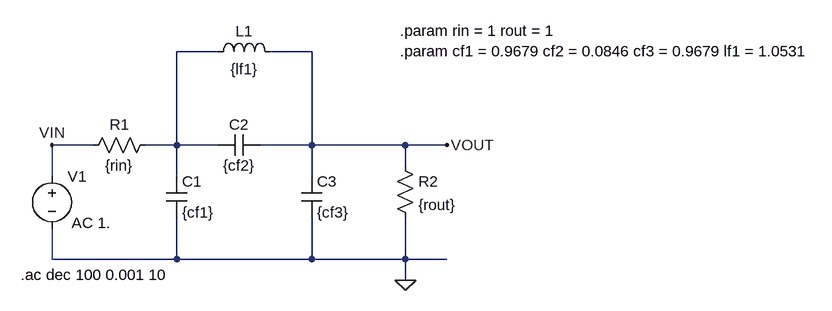
[diagram p0: schematic cauer_passive_filter.asc]
cauer_passive_filter.asc, the LTspice schematic file:
Version 4.1
SHEET 1 1188 680
WIRE 208 -64 144 -64
WIRE 352 -64 288 -64
WIRE 16 80 -48 80
WIRE 144 80 144 -64
WIRE 144 80 96 80
WIRE 208 80 144 80
WIRE 352 80 352 -64
WIRE 352 80 272 80
WIRE 496 80 352 80
WIRE 560 80 496 80
WIRE 496 112 496 80
WIRE -48 128 -48 80
WIRE 144 128 144 80
WIRE 352 128 352 80
WIRE -48 256 -48 208
WIRE 144 256 144 192
WIRE 144 256 -48 256
WIRE 352 256 352 192
WIRE 352 256 144 256
WIRE 496 256 496 192
WIRE 496 256 352 256
WIRE 560 256 496 256
WIRE 496 288 496 256
FLAG 496 288 0
FLAG -48 80 VIN
FLAG 560 80 VOUT
SYMBOL res 112 64 R90
WINDOW 0 0 56 VBottom 2
WINDOW 3 32 56 VTop 2
SYMATTR InstName R1
SYMATTR Value {rin}
SYMBOL cap 128 128 R0
SYMATTR InstName C1
SYMATTR Value {cf1}
SYMBOL cap 272 64 R90
WINDOW 0 0 32 VBottom 2
WINDOW 3 32 32 VTop 2
SYMATTR InstName C2
SYMATTR Value {cf2}
SYMBOL ind 192 -48 R270
WINDOW 0 32 56 VTop 2
WINDOW 3 5 56 VBottom 2
SYMATTR InstName L1
SYMATTR Value {lf1}
SYMATTR SpiceLine Rser=1m
SYMBOL cap 336 128 R0
SYMATTR InstName C3
SYMATTR Value {cf3}
SYMBOL res 480 96 R0
SYMATTR InstName R2
SYMATTR Value {rout}
SYMBOL voltage -48 112 R0
WINDOW 123 30 88 Left 2
WINDOW 39 0 0 Left 0
SYMATTR Value2 AC 1.
SYMATTR InstName V1
SYMATTR Value ""
TEXT -96 280 Left 2 !.ac dec 100 0.001 10
TEXT 488 -96 Left 2 !.param rin = 1 rout = 1\n.param cf1 = 0.9679 cf2 = 0.0846 cf3 = 0.9679 lf1 = 1.0531

The netlist it stands for:
* cauer_passive_filter.asc
R1 N001 VIN {rin}
C1 N001 0 {cf1}
C2 VOUT N001 {cf2}
L1 N001 VOUT {lf1} Rser=1m
C3 VOUT 0 {cf3}
R2 VOUT 0 {rout}
V1 VIN 0 AC 1.
.ac dec 100 0.001 10
.param rin = 1 rout = 1
.param cf1 = 0.9679 cf2 = 0.0846 cf3 = 0.9679 lf1 = 1.0531
.backanno
.end